# Altium project ScreenBase.PrjPcb
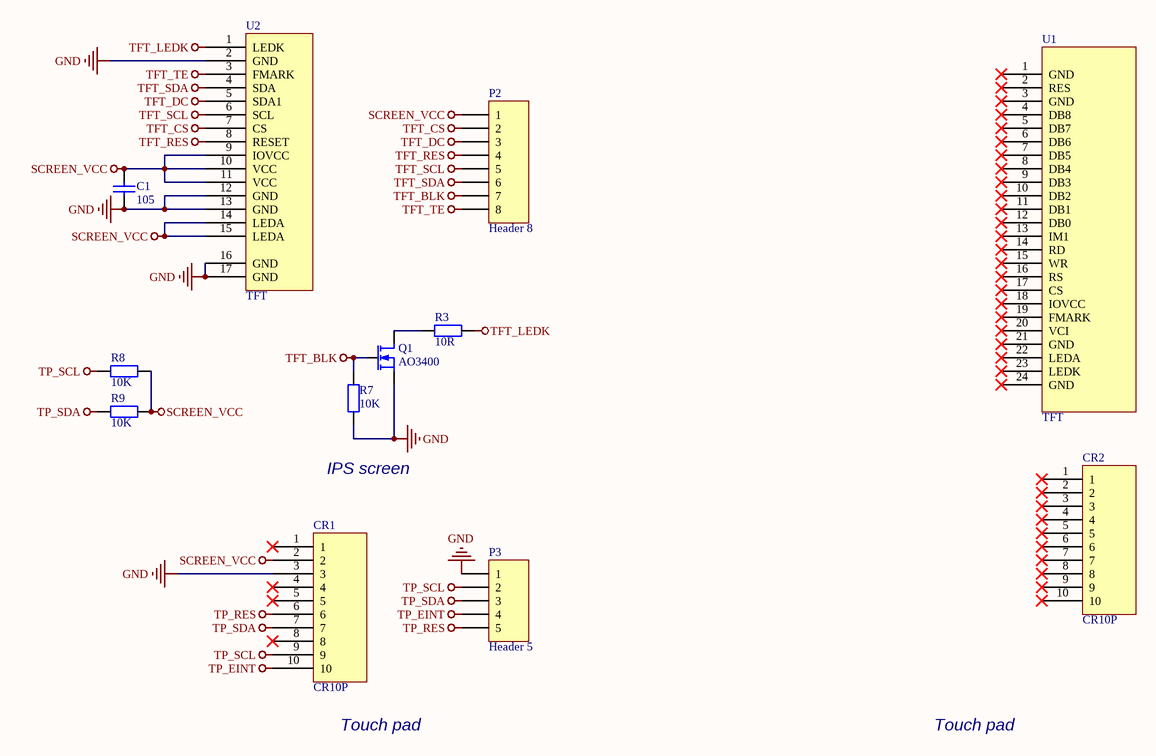
[diagram p0: ScreenBase.SchDoc]
1 sheet, 12 parts. Net scope: global (net labels, ports and power ports of the same name join across sheets).
Board file: ScreenBase.PcbDoc

## Sheet ScreenBase.SchDoc
size A4

### Parts
C1  105  [电容_C0603]
CR1  CR10P  [CONN RCPT 10POS 0.4MM]
CR2  CR10P  [CONN RCPT 10POS 0.4MM]
P2  Header 8  [HDR1X8]
P3  Header 5  [HDR1X5]
Q1  AO3400  [MOS_SOT-23]
R3  10R  [电阻_R0603]
R7  10K  [电阻_R0603]
R8  10K  [电阻_R0603]
R9  10K  [电阻_R0603]
U1  TFT  [CONN-SMD_DF37NC-24DS-0.4V(51)]
U2  TFT  [FPC-0.30mm-15P]

### Nets
GND: C1.2 CR1.3 P3.1 Q1.3(S) R7.1 U2.2(GND) U2.12(GND) U2.13(GND) U2.16(GND) U2.17(GND)
SCREEN_VCC: C1.1 CR1.2 P2.1 R8.1 R9.1 U2.9(IOVCC) U2.10(VCC) U2.11(VCC) U2.14(LEDA) U2.15(LEDA)
TFT_BLK: P2.7 Q1.1(G) R7.2
TFT_CS: P2.2 U2.7(CS)
TFT_DC: P2.3 U2.5(SDA1)
TFT_LEDK: R3.2 U2.1(LEDK)
TFT_RES: P2.4 U2.8(RESET)
TFT_SCL: P2.5 U2.6(SCL)
TFT_SDA: P2.6 U2.4(SDA)
TFT_TE: P2.8 U2.3(FMARK)
TP_EINT: CR1.10 P3.4
TP_RES: CR1.6 P3.5
TP_SCL: CR1.9 P3.2 R8.2
TP_SDA: CR1.7 P3.3 R9.2
NetQ1_2: Q1.2(D) R3.1

Not connected (* = marked no-connect by the designer): CR1 1* 4* 5* 8*; CR2 1* 2* 3* 4* 5* 6* 7* 8* 9* 10*; U1 1(GND)* 2(RES)* 3(GND)* 4(DB8)* 5(DB7)* 6(DB6)* 7(DB5)* 8(DB4)* 9(DB3)* 10(DB2)* 11(DB1)* 12(DB0)* 13(IM1)* 14(RD)* 15(WR)* 16(RS)* 17(CS)* 18(IOVCC)* 19(FMARK)* 20(VCI)* 21(GND)* 22(LEDA)* 23(LEDK)* 24(GND)*

### Notes on the sheet
- IPS screen
- Touch pad

### Library data of the parts
C1 = cap: U: 50V; 参数: Cap,0805,X7R,104K,50V,125C,±10%; C: 105
CR1 CR2 = CONN RCPT 10P: 板对板连接器
P2 = Header 8: Header, 8-Pin; LatestRevisionDate: 17-Jul-2002; LatestRevisionNote: Re-released for DXP Platform.; Publisher: Altium Limited
P3 = Header 5: Header, 5-Pin; LatestRevisionDate: 17-Jul-2002; LatestRevisionNote: Re-released for DXP Platform.; Publisher: Altium Limited
Q1 = MOSFET-N: _Comma: ,; _Current: 150A; _Footprint: DFN5*6; _Name: N-MOSFET; _Specification: N-MOSFET,AO3400,DFN5*6,150A,30V; _Voltage: 30V; _Model: AO3400
R3 = Res: _Accuracy: 1%; _Power: 1/8W; _Footprint: 0805; _Drift: 100ppm; _Comma: ,; _Specification: Res,0805,10R,1%,1/8W,100ppm; _Name: Res; _Value: 10R
R7-R9 = Res: _Accuracy: 1%; _Power: 1/8W; _Footprint: 0805; _Drift: 100ppm; _Comma: ,; _Specification: Res,0805,10K,1%,1/8W,100ppm; _Name: Res; _Value: 10K
U1 = TFT_IPS_8Bit_1.54_240*240
U2 = TFT_IPS1-1.54寸240*240-AML015410V1: IPS电容式触摸屏